# EAGLE schematic Board (EAGLE 9.6.2)
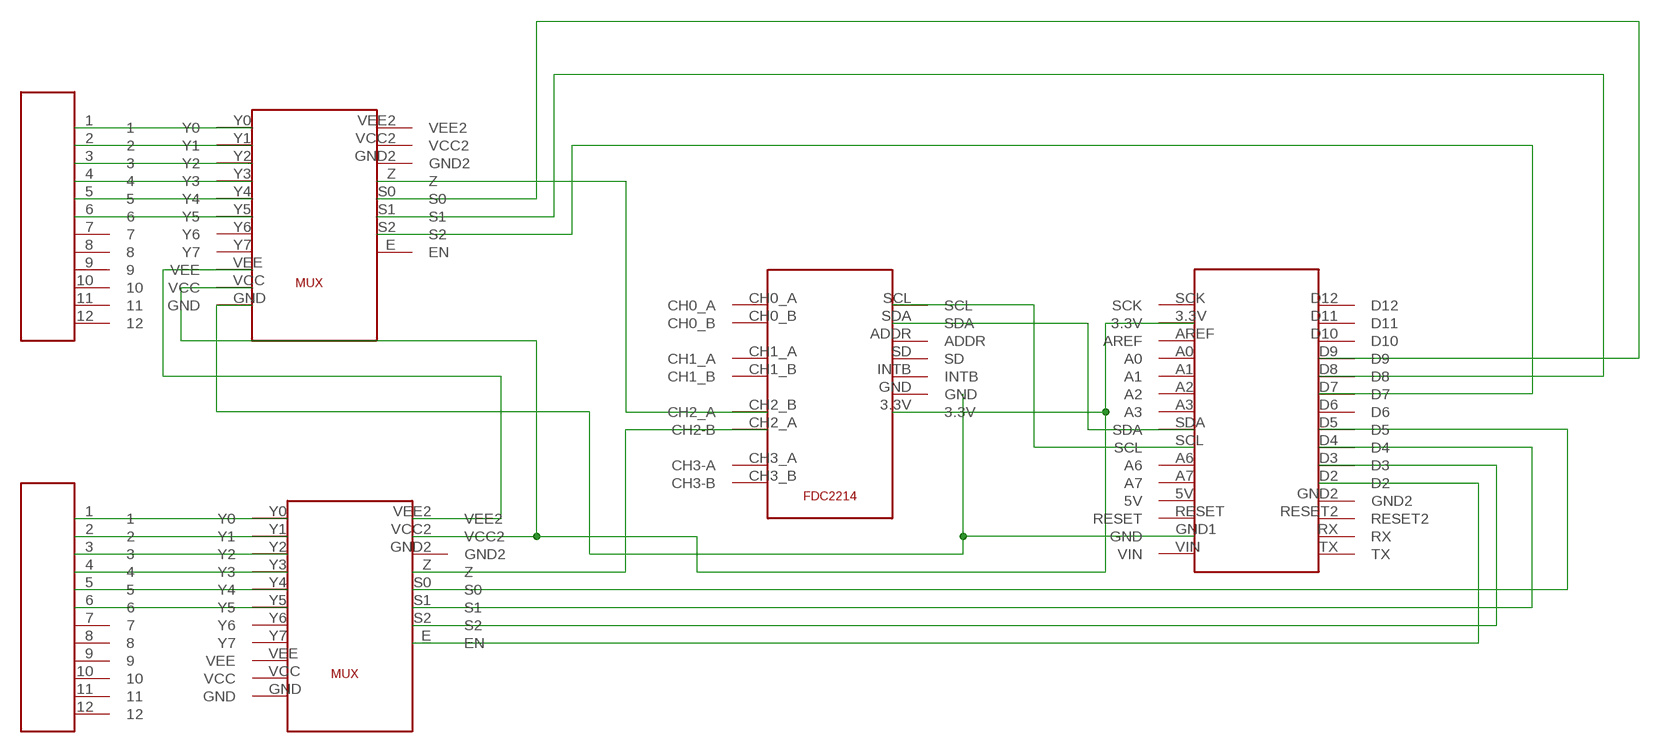
[diagram p0: schematic, sheet 1]

## Parts
U$1  BLE33BLE33  [BLE33]
U$2  MUXMUX  [MUX]
U$3  MUXMUX  [MUX]
U$4  MOLEXMOLEX  [MOLEX]
U$5  MOLEXMOLEX  [MOLEX]
U$6  FDC2214FDC2214  [FDC2214]

## Nets
N$1: U$2.Y0 U$4.1
N$2: U$2.Y1 U$4.2
N$3: U$2.Y2 U$4.3
N$4: U$2.Y3 U$4.4
N$5: U$2.Y4 U$4.5
N$6: U$2.Y5 U$4.6
N$7: U$3.Y0 U$5.1
N$8: U$3.Y1 U$5.2
N$9: U$3.Y2 U$5.3
N$10: U$3.Y3 U$5.4
N$11: U$3.Y4 U$5.5
N$12: U$3.Y5 U$5.6
N$14: U$3.Z U$6.CH2_A(CH2-B)
N$15: U$2.Z U$6.CH2_B(CH2_A)
N$16: U$1.SCL U$6.SCL
N$17: U$1.SDA U$6.SDA
N$18: U$1.D2 U$3.E(EN)
N$19: U$1.D3 U$3.S2
N$20: U$1.3.3V U$2.VCC U$3.VCC2 U$6.3.3V
N$22: U$1.D4 U$3.S1
N$23: U$1.D5 U$3.S0
N$25: U$1.D7 U$2.S2
N$26: U$1.D8 U$2.S1
N$27: U$1.D9 U$2.S0
N$28: U$2.VEE U$3.VEE2
N$30: U$1.GND1(GND) U$2.GND
Unconnected: U$1.5V U$1.A0 U$1.A1 U$1.A2 U$1.A3 U$1.A6 U$1.A7 U$1.AREF U$1.D6 U$1.D10 U$1.D11 U$1.D12 U$1.GND2 U$1.RESET U$1.RESET2 U$1.RX U$1.SCK U$1.TX U$1.VIN U$2.E(EN) U$2.GND2 U$2.VCC2 U$2.VEE2 U$2.Y6 U$2.Y7 U$3.GND U$3.GND2 U$3.VCC U$3.VEE U$3.Y6 U$3.Y7 U$4.7 U$4.8 U$4.9 U$4.10 U$4.11 U$4.12 U$5.7 U$5.8 U$5.9 U$5.10 U$5.11 U$5.12 U$6.ADDR U$6.CH0_A U$6.CH0_B U$6.CH1_A U$6.CH1_B U$6.CH3_A(CH3-A) U$6.CH3_B(CH3-B) U$6.GND U$6.INTB U$6.SD

## Library data of the parts
U$1 = BLE33_EAGLE:BLE33
U$2 U$3 = MUX_eagle:MUX
U$4 U$5 = mOLEX_EAGLE:MOLEX
U$6 = fdc2214_EAGLE:FDC2214